# EAGLE design base3-5pin-interface-SDA-SCL-Switch-on-output (EAGLE 6.5.0)
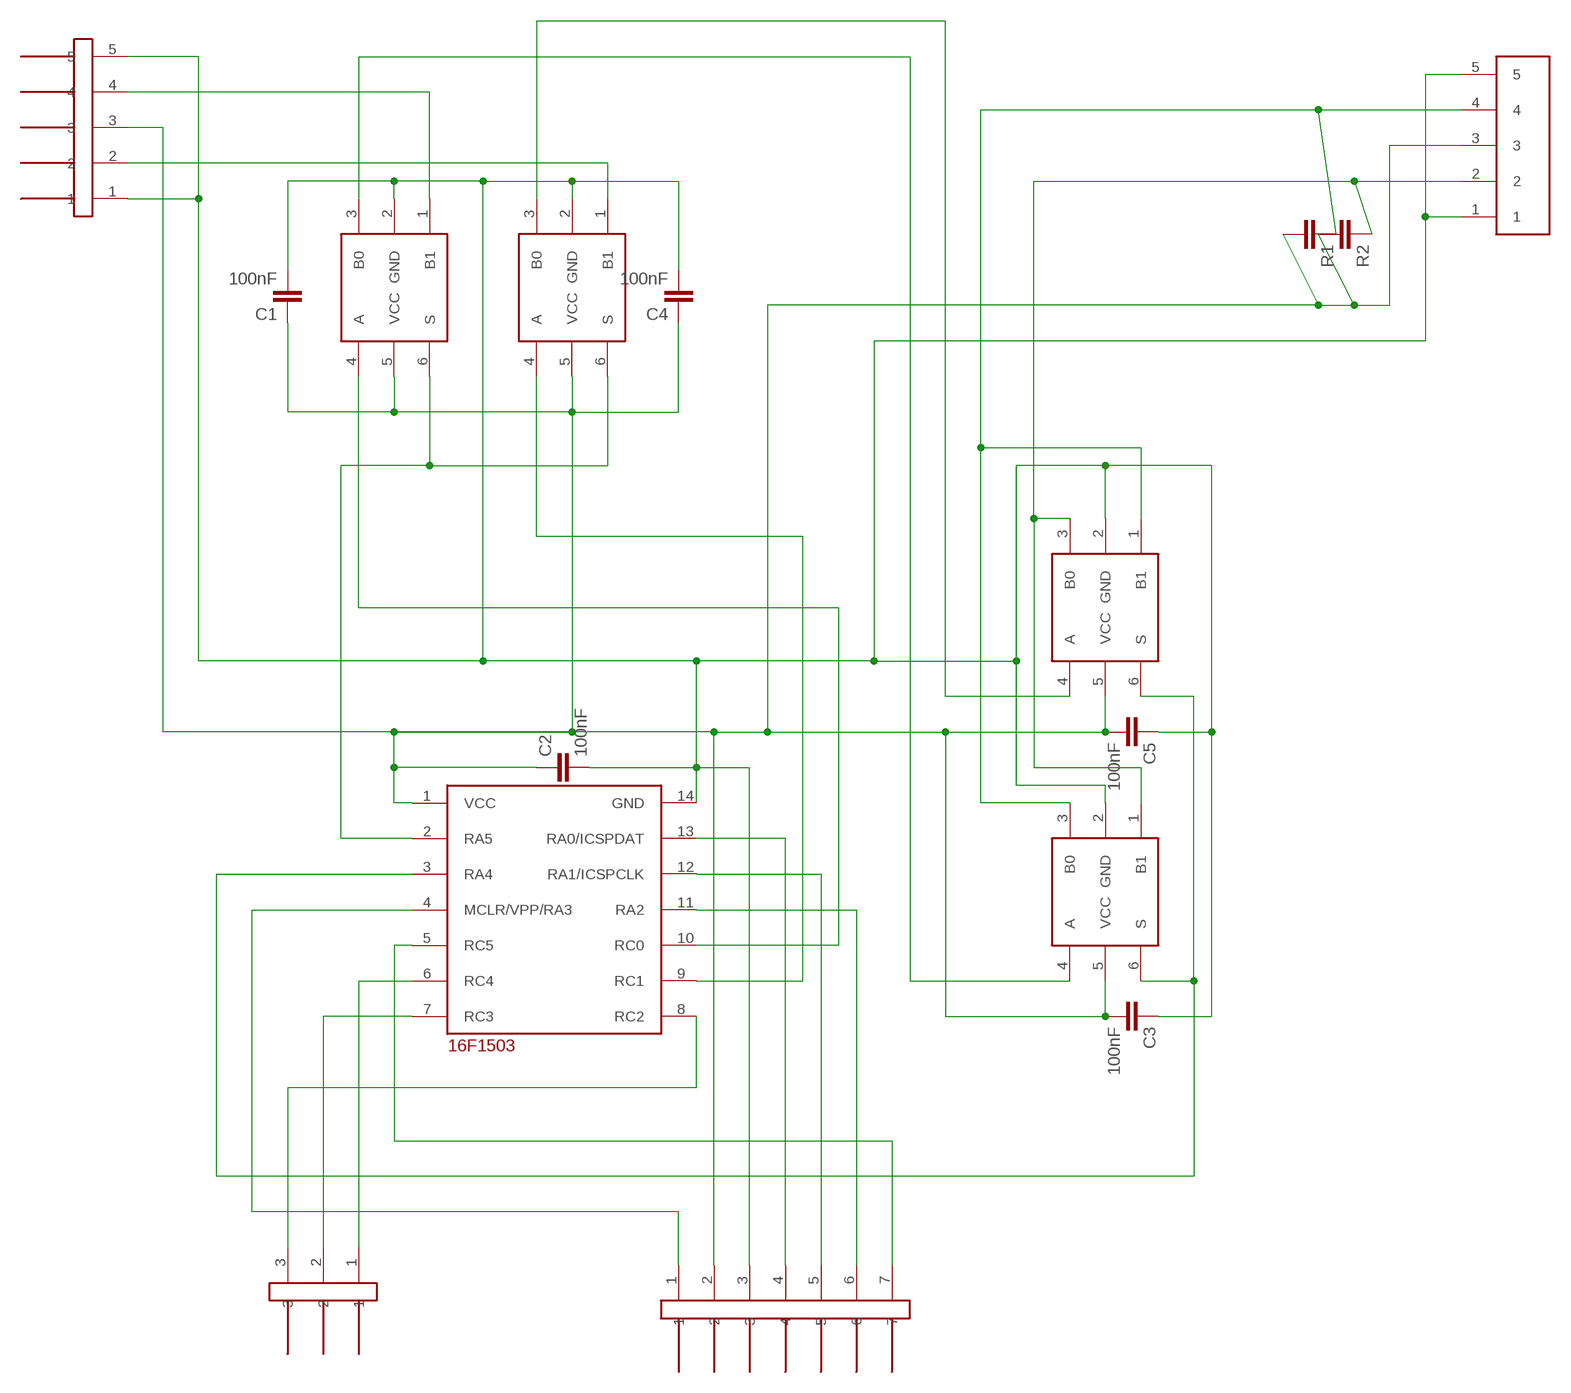
[diagram p0: schematic, sheet 1]

## Parts
C1  100nF  C-EUC0805  [C0805]
C2  100nF  C-EUC0805  [C0805]
C3  100nF  C-EUC0805  [C0805]
C4  100nF  C-EUC0805  [C0805]
C5  100nF  C-EUC0805  [C0805]
R1  C-EUC0805  [C0805]
R2  C-EUC0805  [C0805]
U$1  16F103-TSSOP  [TSSOP14]
U$2  NC7SB3157P6X  [SC70-6L]
U$3  NC7SB3157P6X  [SC70-6L]
U$4  JUMPER5  [JUMPER5]
U$5  JUMPER5F  [JUMPER5F]
U$6  NC7SB3157P6X  [SC70-6L]
U$7  NC7SB3157P6X  [SC70-6L]
U$8  JUMPER7M  [JUMPER7M]
U$9  JUMPER3M  [JUMPER3M]

## Nets
GND: C1.2 C2.2 C3.1 C4.2 C5.1 U$1.14(GND) U$2.2(GND) U$3.2(GND) U$4.1 U$4.5 U$5.1 U$5.5 U$6.2(GND) U$7.2(GND) U$8.3
N$1: U$1.3(RA4) U$6.6(S) U$7.6(S)
N$2: U$1.10(RC0) U$2.4(A)
N$4: U$1.9(RC1) U$3.4(A)
N$5: U$2.1(B1) U$4.4
N$6: R1.1 U$5.4 U$6.1(B1) U$7.3(B0)
N$7: U$3.3(B0) U$6.4(A)
N$8: U$3.1(B1) U$4.2
N$9: U$1.2(RA5) U$2.6(S) U$3.6(S)
N$10: R2.1 U$5.2 U$6.3(B0) U$7.1(B1)
N$11: U$1.11(RA2) U$8.6
N$12: U$1.5(RC5) U$8.7
N$13: U$1.4(MCLR/VPP/RA3) U$8.1
N$14: U$1.13(RA0/ICSPDAT) U$8.4
N$15: U$1.12(RA1/ICSPCLK) U$8.5
N$16: U$1.7(RC3) U$9.2
N$17: U$1.6(RC4) U$9.1
N$18: U$1.8(RC2) U$9.3
N$20: U$2.3(B0) U$7.4(A)
VCC: C1.1 C2.1 C3.2 C4.1 C5.2 R1.2 R2.2 U$1.1(VCC) U$2.5(VCC) U$3.5(VCC) U$4.3 U$5.3 U$6.5(VCC) U$7.5(VCC) U$8.2

## Library data of the parts
C1-C4 R1 R2 = resistor:C-EU: CAPACITOR, European symbol
C5 = rcl:C-EU: CAPACITOR, European symbol
U$1 = !stavebnice03:16F103-TSSOP
U$2 U$3 U$6 U$7 = !stavebnice03:NC7SB3157P6X
U$4 = !stavebnice03:JUMPER5
U$5 = !stavebnice03:JUMPER5F
U$8 = !stavebnice03:JUMPER7M
U$9 = !stavebnice03:JUMPER3M

## Board
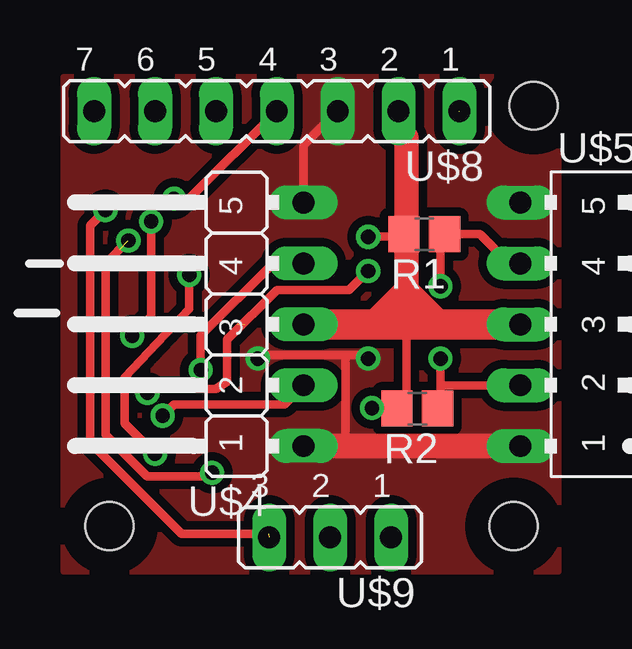
[diagram p1: board, top side]
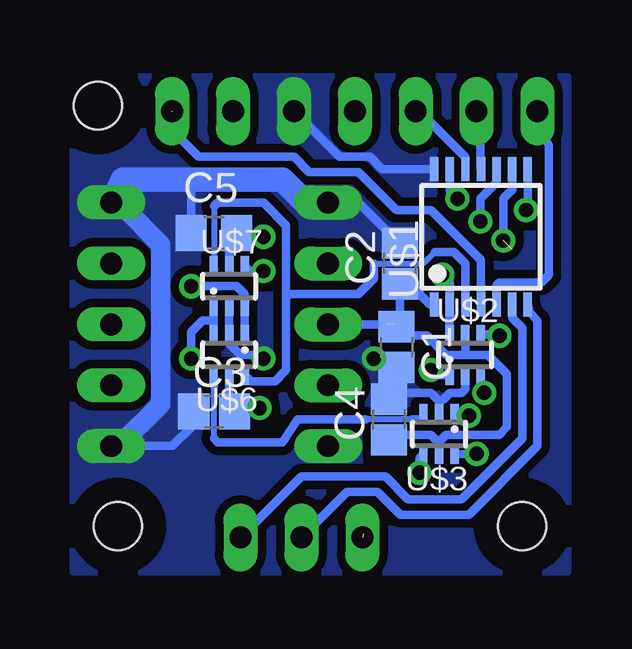
[diagram p2: board, bottom side, seen from below]

No outline drawn. Coordinates in mm, seen from the top.
Copper layers (1*16): Top 0.035mm / dielectric 1.5mm / Bottom 0.035mm
Design rules "default": minimum track width 10mil, minimum drill 24mil, track to track 8mil, track to pad 8mil, pad to pad 8mil, via to via 8mil, smd to smd 8mil, copper to edge 40mil, drill to drill 8mil, minimum pad ring 10mil, minimum via ring 8mil, stop-mask expansion 4mil, vias tented up to drill 0mil, thermal gap 10mil
Holes 2 mm at 2.06,2.06 19.76,19.59 18.92,2.06
tRestrict: area 2.2,8.7 to 2.7,9.7

### Footprints (pad centres in the part's own frame; a part is rotated, then mirrored left to right if it is on the bottom)
C0805 = smd 1.3 x 1.5: 1 -0.85,0; 2 0.85,0
C0805' = smd 1.3 x 1.5: 1 -0.95,0; 2 0.95,0
TSSOP14 = smd 0.35 x 1: 1 -1.95,-2.825; 2 -1.3,-2.825; 3 -0.65,-2.825; 4 0,-2.825; 5 0.65,-2.825; 6 1.3,-2.825; 7 1.95,-2.825; 8 1.95,2.825; 9 1.3,2.825; 10 0.65,2.825; 11 0,2.825; 12 -0.65,2.825; 13 -1.3,2.825; 14 -1.95,2.825
SC70-6L = smd 0.35 x 0.8: 1 -0.65,-0.85; 2 0,-0.85; 3 0.65,-0.85; 4 0.65,0.85; 5 0,0.85; 6 -0.65,0.85
JUMPER5 = drill 0.914 long: 1 -5.08,-2.54; 2 -2.54,-2.54; 3 0,-2.54; 4 2.54,-2.54; 5 5.08,-2.54
JUMPER5F = drill 0.914 long: 1 5.08,-2.54; 2 2.54,-2.54; 3 0,-2.54; 4 -2.54,-2.54; 5 -5.08,-2.54
JUMPER7M = drill 0.914 long: 1 -7.62,0; 2 -5.08,0; 3 -2.54,0; 4 0,0; 5 2.54,0; 6 5.08,0; 7 7.62,0
JUMPER3M = drill 0.914 long: 1 -2.54,0; 2 0,0; 3 2.54,0

### Placement (x,y rotation side)
C1  7.3,9.53 270 bottom
C2  7.17,13.02 90 bottom
C3  14.91,6.84 0 bottom
C4  7.62,6.51 90 bottom
C5  100nF  [C0805']  14.92,14.29 0 bottom
R1  15.2,14.24 180 top
R2  14.91,6.96 180 top
U$1  3.79,14.13 0 bottom
U$2  4.45,9.21 0 bottom
U$3  5.54,5.91 180 bottom
U$4  7.62,10.48 90 top
U$5  21.75,10.48 270 top
U$6  14.29,9.21 180 bottom
U$7  14.29,12.06 0 bottom
U$8  9.05,19.37 180 top
U$9  11.27,1.59 180 top

### Tracks (layer width: path | path; a pad name or v marks a point on that pad's centre or on a via)
GND  (via drill 0.6)
  Top 0.356: 12.06,9.21 12.7,9.21 v12.86,9.05 | 12.06,9.21 8.57,9.21 v8.26,9.05 | U$4.5 10.16,17.94 U$8.3 | 11.91,5.4 11.91,9.05 12.06,9.21
  Top 1.016: U$5.1 11.91,5.4 U$4.1
  Bottom 0.356: U$3.2 5.54,7.28 | 5.54,7.28 5.87,7.62 7.36,7.62 C4.2 | 7.62,7.62 C4.2 | 5.54,7.28 5.38,7.32 5.08,7.62 4.6,7.62 4.45,7.78 U$2.2 | U$8.3 9.68,17.46 8.41,17.46 7.91,16.95 U$1.14 | C5.1 15.87,16.67 15.24,16.51 | U$7.2 U$6.2 14.29,9.68 13.81,9.21 13.18,9.21 v12.86,9.05 | C3.1 15.86,6.21 16.67,5.4 18.89,5.4 U$5.1 | C2.2 7.2,13.87 8.89,15.56 U$4.5 | v8.26,9.05 7.68,9.05 C1.2 7.2,8.68 7.46,8.41 7.46,7.52 C4.2 | 18.73,15.4 19.68,15.4 U$5.5
  Bottom 0.813: 18.89,5.4 17.14,7.14 17.14,13.81 18.73,15.4
  Bottom 1.016: U$4.5 11.11,15.56 12.06,16.51 15.24,16.51 18.73,16.51 U$5.5
  pour Bottom (isolate 0.356, no thermals): 0.16,0.16 0.16,20.8 20.8,20.8 20.8,0.16
  pour Top (isolate 0.356, no thermals): 0.16,0.16 0.16,20.8 20.8,20.8 20.8,0.16
N$1
  Bottom 0.254: 14.92,15.4 14.92,12.77 | 8.26,13.02 6.19,13.02 5.71,13.49
  Bottom 0.356: U$1.3 4.44,13.01 4.92,13.49 5.71,13.49 | 14.92,15.4 14.76,15.56 12.86,15.56 11.91,14.61 11.91,11.59 | 14.92,12.77 U$7.6 | 11.91,11.59 11.91,8.57 12.38,8.1 13.38,8.1 U$6.6 | 11.91,11.59 11.75,11.75 8.89,11.75 8.26,12.38 8.26,13.02
N$2  (via drill 0.6)
  Top 0.356: v3.02,10 3.81,10.79 v3.81,14.76
  Bottom 0.356: 3.79,10.18 U$2.4 3.28,10.06 v3.02,10 | U$1.10 3.14,16.39 3.81,15.72 v3.81,14.76
N$4  (via drill 0.6)  (1 unrouted)
  Top 0.356: v2.86,13.97 1.91,13.02 1.91,5.87 3.65,4.13 6.03,4.13 v6.35,4.29
  Bottom 0.356: v6.35,4.29 6.35,4.89 U$3.4 | U$1.9 2.49,16.09 2.86,15.72 v2.86,13.97
N$5  (via drill 0.6)
  Top 0.356: v5.87,8.57 5.87,10 8.89,13.02 U$4.4
  Bottom 0.356: U$2.1 5.66,8.36 v5.87,8.57
N$6  (via drill 0.6)
  Top 0.356: U$5.4 18.73,13.02 17.51,14.24 R1.1 16.03,14.22 15.88,13.97 v15.88,12.06
  Bottom 0.356: U$6.1 U$7.3 13.64,11.73 13.97,12.06 v15.88,12.06
N$7
  Bottom 0.254: 14.92,5.71 14.92,7.94 | 6.67,6.51 8.57,6.51
  Bottom 0.356: 6.67,6.51 6.19,6.51 U$3.3 | 8.57,6.51 11.43,6.51 12.06,5.56 14.76,5.56 14.92,5.71 | 14.92,7.94 14.94,8.11 U$6.4
N$8  (via drill 0.6)
  Top 0.356: v4.29,6.67 4.76,7.14 9.37,7.14 U$4.2
  Bottom 0.356: U$3.1 4.67,6.6 4.6,6.67 v4.29,6.67
N$9  (via drill 0.6)
  Top 0.356: v5.4,12.54 5.4,11.11 2.7,8.26 2.7,6.35 v3.97,5.08
  Bottom 0.356: U$2.6 U$1.2 5.09,12.23 v5.4,12.54 | U$3.6 4.74,5.06 v3.97,5.08
N$10  (via drill 0.6)
  Top 0.356: 15.88,7.94 15.88,7.23 R2.1 | U$5.2 15.88,7.94 | 15.88,7.94 v15.88,9.05
  Bottom 0.356: U$6.3 14.94,10.64 | 14.94,10.64 U$7.1 | v15.88,9.05 15.88,10.16 15.4,10.64 14.94,10.64
N$11
  Bottom 0.356: U$1.11 3.81,16.98 3.81,18.89 3.94,19.03 3.94,19.18 U$8.6
N$12
  Bottom 0.356: U$1.5 3.14,12.1 3.02,12.22 1.27,12.22 0.95,12.54 0.95,17.94 1.43,18.73 U$8.7
N$13  (1 unrouted)
  Bottom 0.356: U$1.4 3.79,13.15 5.87,15.24 7.3,15.24 8.89,16.83 10.95,16.83 11.59,17.46 15.56,17.46 16.67,18.57 16.67,19.34
N$14  (via drill 0.6)
  Top 0.356: v4.76,15.72 5.4,15.72 U$8.4
  Bottom 0.356: v4.76,15.72 5.09,16.04 U$1.13
N$15
  Bottom 0.356: U$1.12 4.44,17.45 6.03,19.05 6.19,19.05 U$8.5
N$16
  Bottom 0.356: U$1.7 1.78,10.99 1.43,10.64 1.43,5.4 4.29,2.54 7.14,2.54 8.1,3.49 9.37,3.49 U$9.2
N$17
  Bottom 0.356: U$1.6 2.49,10.74 2.06,10.32 2.06,5.71 4.6,3.17 6.83,3.17 7.78,4.13 11.27,4.13 U$9.1
N$18  (via drill 0.6)  (1 unrouted)
  Top 0.356: 8.7,1.75 5.08,1.75 1.27,5.56 1.27,14.61 v1.91,15.24
  Bottom 0.356: U$1.8 1.84,15.31 v1.91,15.24
N$20  (via drill 0.6)
  Top 0.356: v3.65,7.62 3.97,7.78 6.51,7.78 6.99,8.1 6.99,9.84 9.05,11.91 12.06,11.91 v12.86,12.7
  Bottom 0.356: U$2.3 3.79,7.92 v3.65,7.62 | v12.86,12.7 13.42,12.7 U$7.4
VCC  (via drill 0.6)  (1 unrouted)
  Top 0.356: v12.86,14.13 14.45,14.13 14.45,13.81 | 17.2,10.43 16.99,10.48 | 14.45,10.64 14.61,10.48 | R1.2 14.35,14.06 14.45,13.97 | 14.13,10.48 14.38,10.41 14.45,10.34 14.45,7.35 R2.2 13.04,6.96 v13.02,6.99
  Top 1.016: U$8.2 14.13,18.57 14.45,18.26 14.45,14.13 14.45,13.97 14.45,13.81 14.45,11.91 | 14.45,11.91 14.45,10.64 | 15.56,10.79 14.45,11.91 | 14.45,11.91 13.02,10.48
  Top 1.27: U$4.3 13.02,10.48 14.13,10.48 14.61,10.48 16.99,10.48 U$5.3
  Bottom 0.356: 7.46,5.56 C4.1 7.46,5.87 5.87,5.87 5.58,5.58 5.54,5.58 | 4.45,9.21 5.24,9.21 6.03,10 6.77,10 C1.1 | 4.45,9.21 3.49,9.21 2.7,8.41 2.7,6.19 3.02,5.87 5.24,5.87 5.54,5.58 | U$2.5 4.45,9.21 | U$4.3 7.72,10.48 | U$7.5 14.29,13.65 13.97,13.97 C5.2 13.97,13.97 v12.86,14.13 | 14.29,7.32 C3.2 | 7.42,10.49 C1.1 | 6.91,11.91 C2.1 | C2.1 7.17,10.4 C1.1 | U$1.1 5.91,11.3 6.67,12.06 7.07,12.06 C2.1 | U$6.5 14.29,7.32 | 14.29,7.32 14.15,7.01 v13.02,6.99 | U$3.5 5.54,5.58